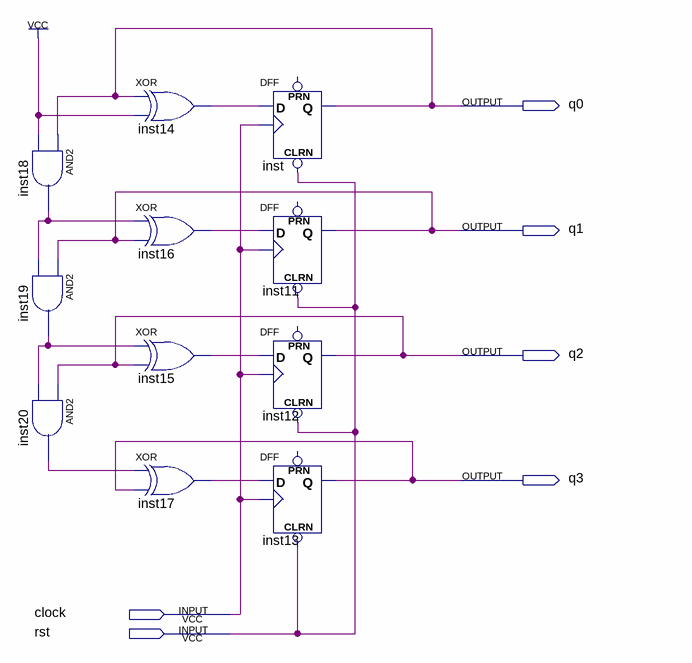
[diagram p0: schematic sheet]
// Quartus schematic SyncUpSchem.bdf as structural Verilog: 11 symbols, 6 pins
module SyncUpSchem (
  input  clock,
  input  rst,
  output q0,
  output q1,
  output q2,
  output q3
);

  wire inst14_out, inst15_out, inst16_out, inst17_out, inst18_out, inst19_out, inst20_out;

  and inst18 (inst18_out, q0, 1'b1);
  and inst19 (inst19_out, q1, inst18_out);
  and inst20 (inst20_out, q2, inst19_out);
  xor inst14 (inst14_out, q0, 1'b1);
  xor inst16 (inst16_out, inst18_out, q1);
  xor inst15 (inst15_out, inst19_out, q2);
  xor inst17 (inst17_out, inst20_out, q3);
  DFF inst (.CLRN(rst), .CLK(clock), .D(inst14_out), .Q(q0));  // open: PRN
  DFF inst11 (.CLRN(rst), .CLK(clock), .D(inst16_out), .Q(q1));  // open: PRN
  DFF inst12 (.CLRN(rst), .CLK(clock), .D(inst15_out), .Q(q2));  // open: PRN
  DFF inst13 (.CLRN(rst), .CLK(clock), .D(inst17_out), .Q(q3));  // open: PRN
endmodule
